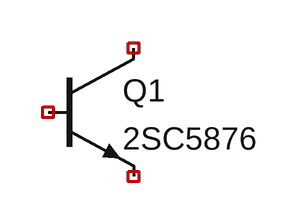
[diagram p0: schematic Draft14.asc]
Draft14.asc, the LTspice schematic file:
Version 4
SHEET 1 880 680
SYMBOL npn 192 176 R0
SYMATTR InstName Q1
SYMATTR Value 2SC5876

The netlist it stands for:
* Draft14.asc
Q1 NC_01 NC_02 NC_03 0 2SC5876
.model NPN NPN
.model PNP PNP
.lib standard.bjt
.backanno
.end